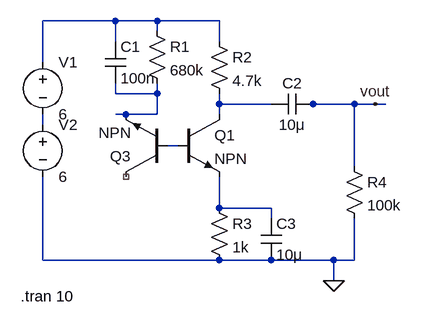
[diagram p0: schematic whitenoise.asc]
whitenoise.asc, the LTspice schematic file:
Version 4
SHEET 1 880 680
WIRE -672 -16 -784 -16
WIRE -608 -16 -672 -16
WIRE -512 -16 -608 -16
WIRE -608 0 -608 -16
WIRE -672 16 -672 -16
WIRE -512 16 -512 -16
WIRE -784 48 -784 -16
WIRE -672 96 -672 80
WIRE -608 96 -608 80
WIRE -608 96 -672 96
WIRE -512 112 -512 96
WIRE -432 112 -512 112
WIRE -368 112 -384 112
WIRE -304 112 -368 112
WIRE -272 112 -304 112
WIRE -256 112 -272 112
WIRE -656 128 -672 128
WIRE -608 128 -608 96
WIRE -608 128 -656 128
WIRE -512 128 -512 112
WIRE -784 144 -784 128
WIRE -576 176 -592 176
WIRE -304 208 -304 112
WIRE -512 272 -512 224
WIRE -432 272 -512 272
WIRE -432 288 -432 272
WIRE -784 352 -784 224
WIRE -512 352 -784 352
WIRE -432 352 -512 352
WIRE -336 352 -432 352
WIRE -304 352 -304 288
WIRE -304 352 -336 352
WIRE -336 384 -336 352
FLAG -336 384 0
FLAG -272 112 vout
SYMBOL voltage -784 32 R0
WINDOW 123 0 0 Left 0
WINDOW 39 0 0 Left 0
SYMATTR InstName V1
SYMATTR Value 6
SYMBOL voltage -784 128 R0
WINDOW 123 0 0 Left 0
WINDOW 39 0 0 Left 0
SYMATTR InstName V2
SYMATTR Value 6
SYMBOL cap -688 16 R0
SYMATTR InstName C1
SYMATTR Value 100n
SYMBOL res -624 -16 R0
SYMATTR InstName R1
SYMATTR Value 680k
SYMBOL res -528 0 R0
SYMATTR InstName R2
SYMATTR Value 4.7k
SYMBOL npn -576 128 R0
SYMATTR InstName Q1
SYMBOL res -528 256 R0
SYMATTR InstName R3
SYMATTR Value 1k
SYMBOL cap -368 96 R90
WINDOW 0 0 32 VBottom 2
WINDOW 3 32 32 VTop 2
SYMATTR InstName C2
SYMATTR Value 10μ
SYMBOL res -320 192 R0
SYMATTR InstName R4
SYMATTR Value 100k
SYMBOL cap -448 288 R0
SYMATTR InstName C3
SYMATTR Value 10μ
SYMBOL npn -592 224 R180
SYMATTR InstName Q3
TEXT -818 408 Left 2 !.tran 10

The netlist it stands for:
* whitenoise.asc
V1 N001 N004 6
V2 N004 0 6
C1 N001 N002 100n
R1 N001 N002 680k
R2 N001 N003 4.7k
Q1 N003 N005 N006 0 NPN
R3 N006 0 1k
C2 vout N003 10μ
R4 vout 0 100k
C3 N006 0 10μ
Q3 NC_01 N005 N002 0 NPN
.model NPN NPN
.model PNP PNP
.lib standard.bjt
.tran 10
.backanno
.end